# Altium schematic sheet BMD_RevB_B3_FPGA.SchDoc: FPGA
size 401 x 291 mm; DocumentNumber: 2; SheetNumber: 3; SheetTotal: 6
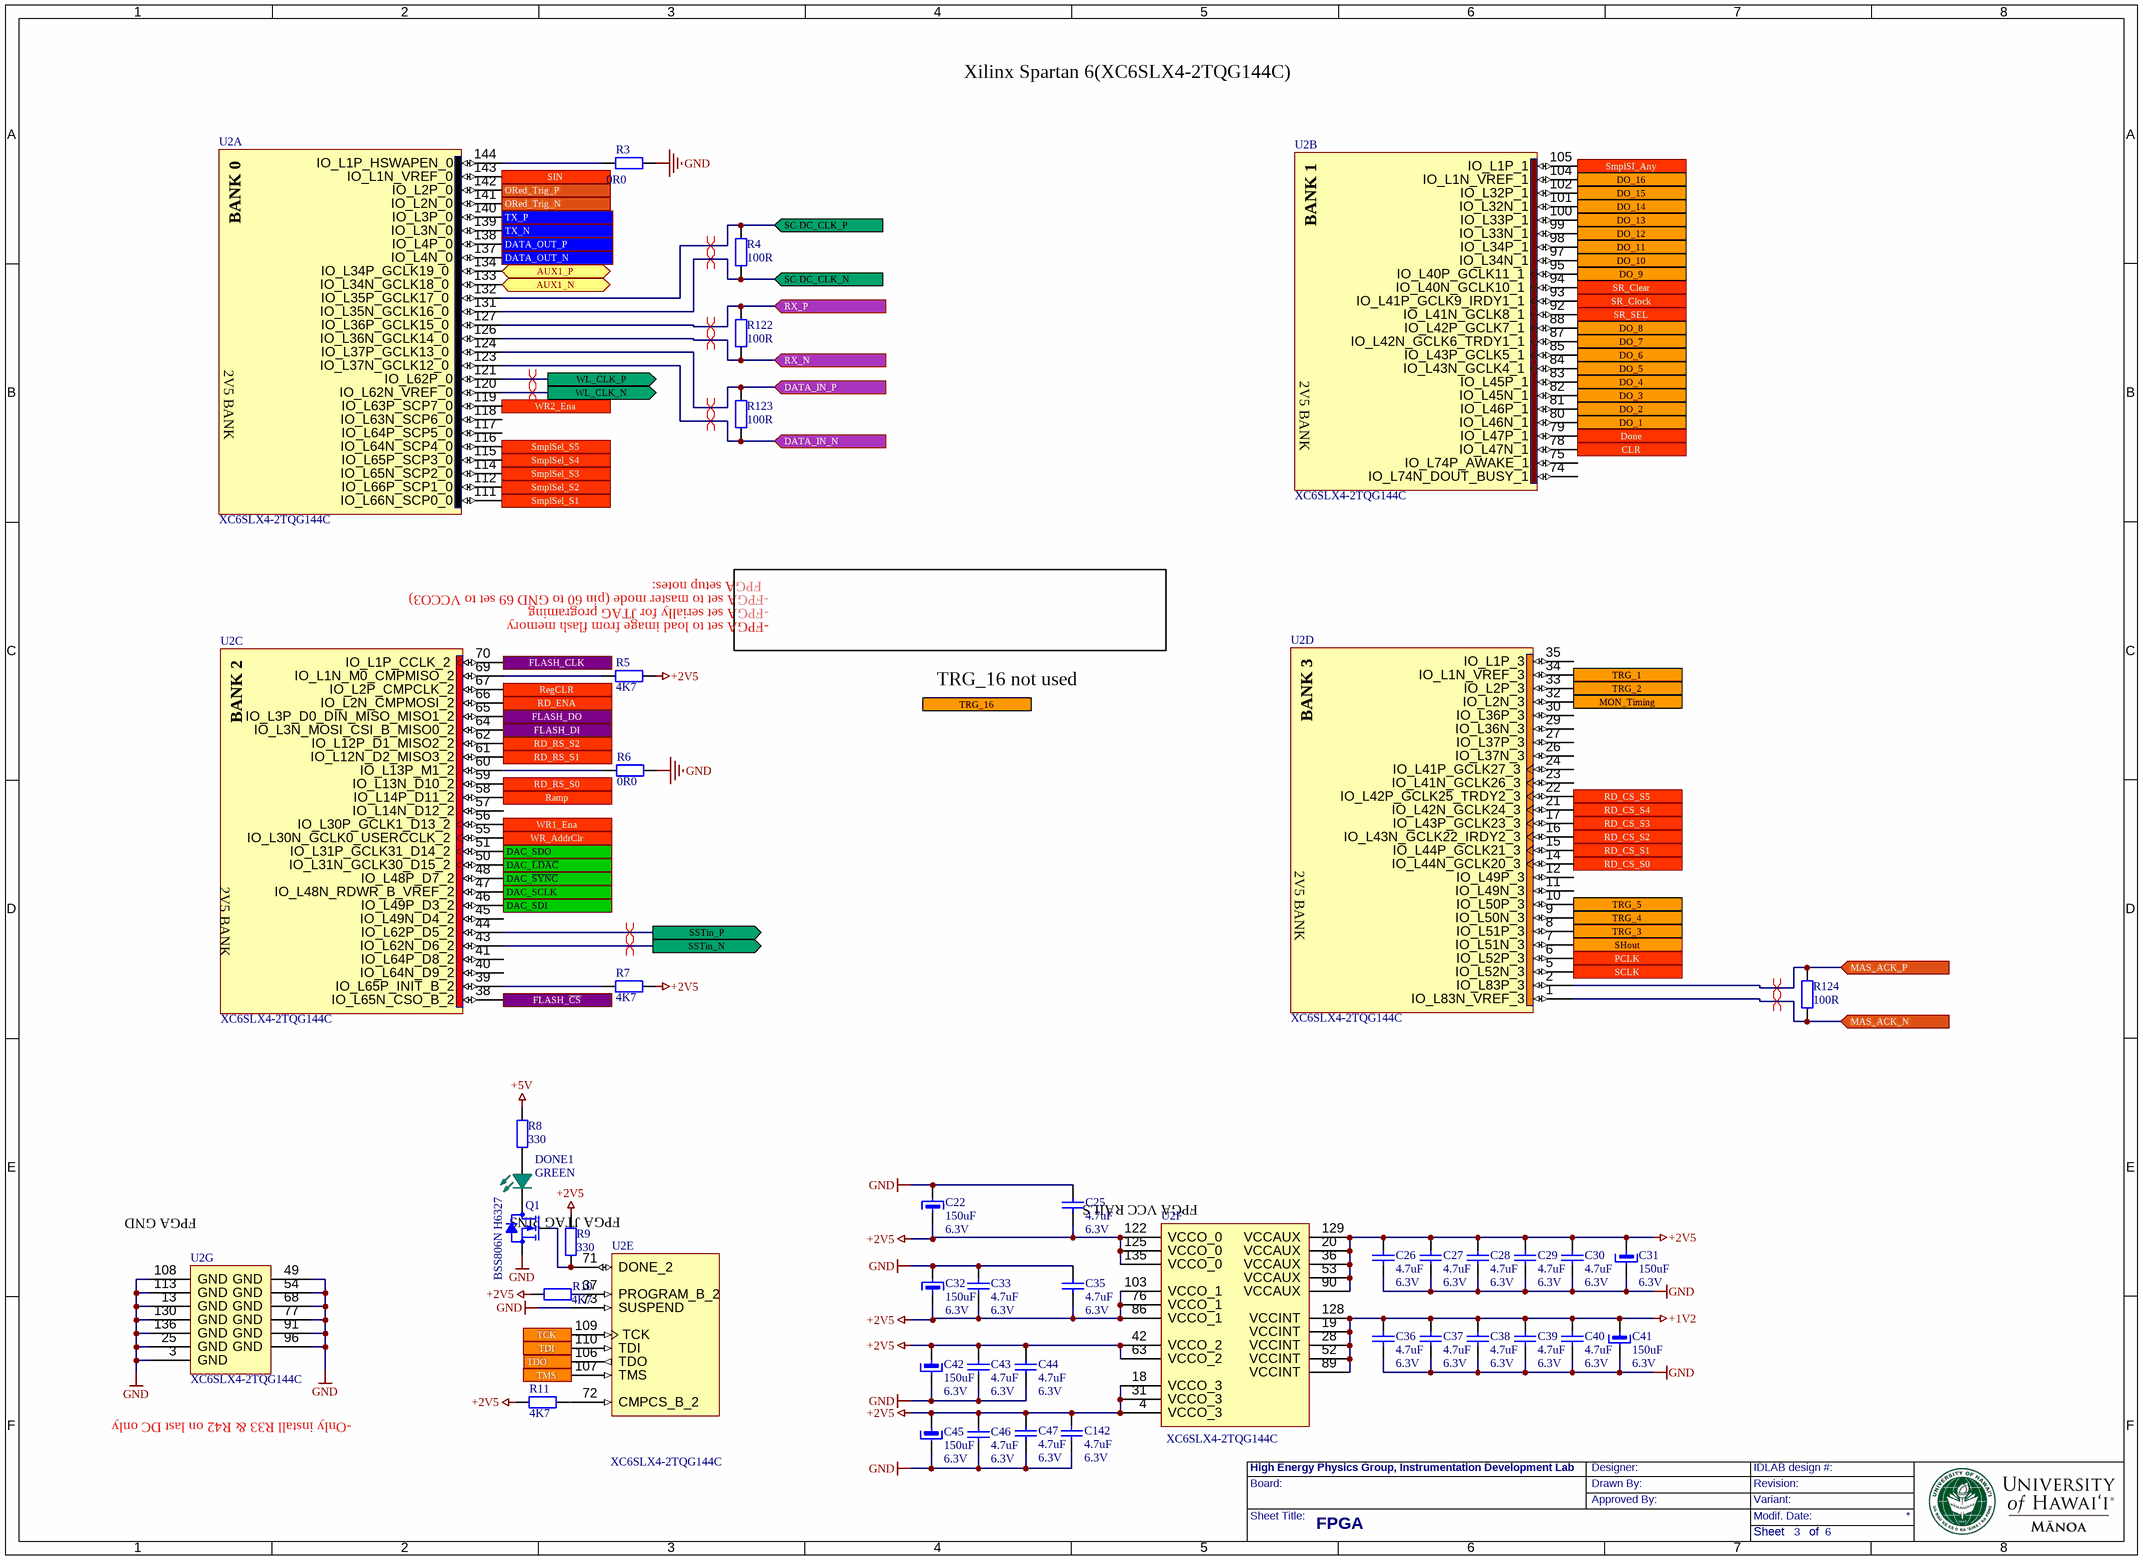
[diagram p0: BMD_RevB_B3_FPGA.SchDoc]

## Parts
C22  150uF  Voltage: 6.3V  [CTC-B3528-21]
C25  4.7uF  Voltage rating: 6.3V  [CC0402N1R]
C26  4.7uF  Voltage rating: 6.3V  [CC0402N1R]
C27  4.7uF  Voltage rating: 6.3V  [CC0402N1R]
C28  4.7uF  Voltage rating: 6.3V  [CC0402N1R]
C29  4.7uF  Voltage rating: 6.3V  [CC0402N1R]
C30  4.7uF  Voltage rating: 6.3V  [CC0402N1R]
C31  150uF  Voltage: 6.3V  [CTC-B3528-21]
C32  150uF  Voltage: 6.3V  [CTC-B3528-21]
C33  4.7uF  Voltage rating: 6.3V  [CC0402N1R]
C35  4.7uF  Voltage rating: 6.3V  [CC0402N1R]
C36  4.7uF  Voltage rating: 6.3V  [CC0402N1R]
C37  4.7uF  Voltage rating: 6.3V  [CC0402N1R]
C38  4.7uF  Voltage rating: 6.3V  [CC0402N1R]
C39  4.7uF  Voltage rating: 6.3V  [CC0402N1R]
C40  4.7uF  Voltage rating: 6.3V  [CC0402N1R]
C41  150uF  Voltage: 6.3V  [CTC-B3528-21]
C42  150uF  Voltage: 6.3V  [CTC-B3528-21]
C43  4.7uF  Voltage rating: 6.3V  [CC0402N1R]
C44  4.7uF  Voltage rating: 6.3V  [CC0402N1R]
C45  150uF  Voltage: 6.3V  [CTC-B3528-21]
C46  4.7uF  Voltage rating: 6.3V  [CC0402N1R]
C47  4.7uF  Voltage rating: 6.3V  [CC0402N1R]
C142  4.7uF  Voltage rating: 6.3V  [CC0402N1R]
DONE1  GREEN  [LED0603VG]
Q1  BSS806N H6327  [SOT23-1]
R3  0R0  [RC0402N1R]
R4  100R  [RC0402N1R]
R5  4K7  [RC0402N1R]
R6  0R0  [RC0402N1R]
R7  4K7  [RC0402N1R]
R8  330  [RC0402N1R]
R9  330  [RC0402N1R]
R10  4K7  [RC0402N1R]
R11  4K7  [RC0402N1R]
R122  100R  [RC0402N1R]
R123  100R  [RC0402N1R]
R124  100R  [RC0402N1R]
U2  XC6SLX4-2TQG144C  [TQG144_N]  (parts A,B,C,D,E,F,G of 7)

## Ports
AUX1_N (bidir), AUX1_P (bidir), CLR (out), DAC_SCLK (in), DAC_SDI (in), DAC_SDO (out), DAC_~{LDAC} (in), DAC_~{SYNC} (in), DATA_IN_N (in), DATA_IN_P (in), DATA_OUT_N (out), DATA_OUT_P (out), DO_1 (in), DO_2 (in), DO_3 (in), DO_4 (in), DO_5 (in), DO_6 (in), DO_7 (in), DO_8 (in), DO_9 (in), DO_10 (in), DO_11 (in), DO_12 (in), DO_13 (in), DO_14 (in), DO_15 (in), DO_16 (in), Done (out), FLASH_CLK (out), FLASH_DI (out), FLASH_DO (in), FLASH_~{CS} (out), MAS_ACK_N (in), MAS_ACK_P (in), MON_Timing (in), ORed_Trig_N (out), ORed_Trig_P (out), PCLK (out), Ramp (out), RD_CS_S0 (out), RD_CS_S1 (out), RD_CS_S2 (out), RD_CS_S3 (out), RD_CS_S4 (out), RD_CS_S5 (out), RD_ENA (out), RD_RS_S0 (out), RD_RS_S1 (out), RD_RS_S2 (out), RegCLR (out), RX_N (in), RX_P (in), SC-DC_CLK_N (in), SC-DC_CLK_P (in), SCLK (out), SHout (in), SIN (out), SmplSel_S1 (out), SmplSel_S2 (out), SmplSel_S3 (out), SmplSel_S4 (out), SmplSel_S5 (out), SmplSI_Any (out), SR_Clear (out), SR_Clock (out), SR_SEL (out), SSTin_N (out), SSTin_P (out), TCK (in), TDI (in), TDO (out), TMS (in), TRG_1 (in), TRG_2 (in), TRG_3 (in), TRG_4 (in), TRG_5 (in), TRG_16 (in), TX_N (out), TX_P (out), WL_CLK_N (out), WL_CLK_P (out), WR1_Ena (out), WR2_Ena (out), WR_AddrClr (out)

## Nets
+1V2: C36.2 C37.2 C38.2 C39.2 C40.2 C41.1 U2.19(VCCINT) U2.28(VCCINT) U2.52(VCCINT) U2.89(VCCINT) U2.128(VCCINT)
+2V5: C22.1 C25.1 C26.2 C27.2 C28.2 C29.2 C30.2 C31.1 C32.1 C33.1 C35.1 C42.1 C43.2 C44.2 C45.1 C46.2 C47.2 C142.2 R5.2 R7.2 R9.1 R10.2 R11.1 U2.4(VCCO_3) U2.18(VCCO_3) U2.20(VCCAUX) U2.31(VCCO_3) U2.36(VCCAUX) U2.42(VCCO_2) U2.53(VCCAUX) U2.63(VCCO_2) U2.76(VCCO_1) U2.86(VCCO_1) U2.90(VCCAUX) U2.103(VCCO_1) U2.122(VCCO_0) U2.125(VCCO_0) U2.129(VCCAUX) U2.135(VCCO_0)
+5V: R8.1
GND: C22.2 C25.2 C26.1 C27.1 C28.1 C29.1 C30.1 C31.2 C32.2 C33.2 C35.2 C36.1 C37.1 C38.1 C39.1 C40.1 C41.2 C42.2 C43.1 C44.1 C45.2 C46.1 C47.1 C142.1 Q1.2(S) R3.2 R6.2 U2.3(GND) U2.13(GND) U2.25(GND) U2.49(GND) U2.54(GND) U2.68(GND) U2.73(SUSPEND) U2.77(GND) U2.91(GND) U2.96(GND) U2.108(GND) U2.113(GND) U2.130(GND) U2.136(GND)
AUX1_N: U2.133(IO_L34N_GCLK18_0) ; port AUX1_N
AUX1_P: U2.134(IO_L34P_GCLK19_0) ; port AUX1_P
CLR: U2.78(IO_L47N_1) ; port CLR
DAC_~{LDAC}: U2.50(IO_L31N_GCLK30_D15_2) ; port DAC_~{LDAC}
DAC_~{SYNC}: U2.48(IO_L48P_D7_2) ; port DAC_~{SYNC}
DAC_SCLK: U2.47(IO_L48N_RDWR_B_VREF_2) ; port DAC_SCLK
DAC_SDI: U2.46(IO_L49P_D3_2) ; port DAC_SDI
DAC_SDO: U2.51(IO_L31P_GCLK31_D14_2) ; port DAC_SDO
DATA_IN_N: R123.1 U2.123(IO_L37N_GCLK12_0) ; port DATA_IN_N
DATA_IN_P: R123.2 U2.124(IO_L37P_GCLK13_0) ; port DATA_IN_P
DATA_OUT_N: U2.137(IO_L4N_0) ; port DATA_OUT_N
DATA_OUT_P: U2.138(IO_L4P_0) ; port DATA_OUT_P
DO_1: U2.80(IO_L46N_1) ; port DO_1
DO_2: U2.81(IO_L46P_1) ; port DO_2
DO_3: U2.82(IO_L45N_1) ; port DO_3
DO_4: U2.83(IO_L45P_1) ; port DO_4
DO_5: U2.84(IO_L43N_GCLK4_1) ; port DO_5
DO_6: U2.85(IO_L43P_GCLK5_1) ; port DO_6
DO_7: U2.87(IO_L42N_GCLK6_TRDY1_1) ; port DO_7
DO_8: U2.88(IO_L42P_GCLK7_1) ; port DO_8
DO_9: U2.95(IO_L40P_GCLK11_1) ; port DO_9
DO_10: U2.97(IO_L34N_1) ; port DO_10
DO_11: U2.98(IO_L34P_1) ; port DO_11
DO_12: U2.99(IO_L33N_1) ; port DO_12
DO_13: U2.100(IO_L33P_1) ; port DO_13
DO_14: U2.101(IO_L32N_1) ; port DO_14
DO_15: U2.102(IO_L32P_1) ; port DO_15
DO_16: U2.104(IO_L1N_VREF_1) ; port DO_16
Done: U2.79(IO_L47P_1) ; port Done
FLASH_~{CS}: U2.38(IO_L65N_CSO_B_2) ; port FLASH_~{CS}
FLASH_CLK: U2.70(IO_L1P_CCLK_2) ; port FLASH_CLK
FLASH_DI: U2.64(IO_L3N_MOSI_CSI_B_MISO0_2) ; port FLASH_DI
FLASH_DO: U2.65(IO_L3P_D0_DIN_MISO_MISO1_2) ; port FLASH_DO
MAS_ACK_N: R124.1 U2.1(IO_L83N_VREF_3) ; port MAS_ACK_N
MAS_ACK_P: R124.2 U2.2(IO_L83P_3) ; port MAS_ACK_P
MON_Timing: U2.32(IO_L2N_3) ; port MON_Timing
ORed_Trig_N: U2.141(IO_L2N_0) ; port ORed_Trig_N
ORed_Trig_P: U2.142(IO_L2P_0) ; port ORed_Trig_P
PCLK: U2.6(IO_L52P_3) ; port PCLK
Ramp: U2.58(IO_L14P_D11_2) ; port Ramp
RD_CS_S0: U2.14(IO_L44N_GCLK20_3) ; port RD_CS_S0
RD_CS_S1: U2.15(IO_L44P_GCLK21_3) ; port RD_CS_S1
RD_CS_S2: U2.16(IO_L43N_GCLK22_IRDY2_3) ; port RD_CS_S2
RD_CS_S3: U2.17(IO_L43P_GCLK23_3) ; port RD_CS_S3
RD_CS_S4: U2.21(IO_L42N_GCLK24_3) ; port RD_CS_S4
RD_CS_S5: U2.22(IO_L42P_GCLK25_TRDY2_3) ; port RD_CS_S5
RD_ENA: U2.66(IO_L2N_CMPMOSI_2) ; port RD_ENA
RD_RS_S0: U2.59(IO_L13N_D10_2) ; port RD_RS_S0
RD_RS_S1: U2.61(IO_L12N_D2_MISO3_2) ; port RD_RS_S1
RD_RS_S2: U2.62(IO_L12P_D1_MISO2_2) ; port RD_RS_S2
RegCLR: U2.67(IO_L2P_CMPCLK_2) ; port RegCLR
RX_N: R122.1 U2.126(IO_L36N_GCLK14_0) ; port RX_N
RX_P: R122.2 U2.127(IO_L36P_GCLK15_0) ; port RX_P
SC-DC_CLK_N: R4.1 U2.131(IO_L35N_GCLK16_0) ; port SC-DC_CLK_N
SC-DC_CLK_P: R4.2 U2.132(IO_L35P_GCLK17_0) ; port SC-DC_CLK_P
SCLK: U2.5(IO_L52N_3) ; port SCLK
SHout: U2.7(IO_L51N_3) ; port SHout
SIN: U2.143(IO_L1N_VREF_0) ; port SIN
SmplSel_S1: U2.111(IO_L66N_SCP0_0) ; port SmplSel_S1
SmplSel_S2: U2.112(IO_L66P_SCP1_0) ; port SmplSel_S2
SmplSel_S3: U2.114(IO_L65N_SCP2_0) ; port SmplSel_S3
SmplSel_S4: U2.115(IO_L65P_SCP3_0) ; port SmplSel_S4
SmplSel_S5: U2.116(IO_L64N_SCP4_0) ; port SmplSel_S5
SmplSI_Any: U2.105(IO_L1P_1) ; port SmplSI_Any
SR_Clear: U2.94(IO_L40N_GCLK10_1) ; port SR_Clear
SR_Clock: U2.93(IO_L41P_GCLK9_IRDY1_1) ; port SR_Clock
SR_SEL: U2.92(IO_L41N_GCLK8_1) ; port SR_SEL
SSTin_N: U2.43(IO_L62N_D6_2) ; port SSTin_N
SSTin_P: U2.44(IO_L62P_D5_2) ; port SSTin_P
TCK: U2.109(TCK) ; port TCK
TDI: U2.110(TDI) ; port TDI
TDO: U2.106(TDO) ; port TDO
TMS: U2.107(TMS) ; port TMS
TRG_1: U2.34(IO_L1N_VREF_3) ; port TRG_1
TRG_2: U2.33(IO_L2P_3) ; port TRG_2
TRG_3: U2.8(IO_L51P_3) ; port TRG_3
TRG_4: U2.9(IO_L50N_3) ; port TRG_4
TRG_5: U2.10(IO_L50P_3) ; port TRG_5
TX_N: U2.139(IO_L3N_0) ; port TX_N
TX_P: U2.140(IO_L3P_0) ; port TX_P
WL_CLK_N: U2.120(IO_L62N_VREF_0) ; port WL_CLK_N
WL_CLK_P: U2.121(IO_L62P_0) ; port WL_CLK_P
WR1_Ena: U2.56(IO_L30P_GCLK1_D13_2) ; port WR1_Ena
WR2_Ena: U2.119(IO_L63P_SCP7_0) ; port WR2_Ena
WR_AddrClr: U2.55(IO_L30N_GCLK0_USERCCLK_2) ; port WR_AddrClr
NetDONE1_1: DONE1.1(C) Q1.3(D)
NetDONE1_2: DONE1.2(A) R8.2
NetQ1_1: Q1.1(G) R9.2 U2.71(DONE_2)
NetR3_1: R3.1 U2.144(IO_L1P_HSWAPEN_0)
NetR5_1: R5.1 U2.69(IO_L1N_M0_CMPMISO_2)
NetR6_1: R6.1 U2.60(IO_L13P_M1_2)
NetR7_1: R7.1 U2.39(IO_L65P_INIT_B_2)
NetR10_1: R10.1 U2.37(PROGRAM_B_2)
NetR11_2: R11.2 U2.72(CMPCS_B_2)

Not connected (* = marked no-connect by the designer): U2 11(IO_L49N_3) 12(IO_L49P_3) 23(IO_L41N_GCLK26_3) 24(IO_L41P_GCLK27_3) 26(IO_L37N_3) 27(IO_L37P_3) 29(IO_L36N_3) 30(IO_L36P_3) 35(IO_L1P_3) 40(IO_L64N_D9_2) 41(IO_L64P_D8_2) 45(IO_L49N_D4_2) 57(IO_L14N_D12_2) 74(IO_L74N_DOUT_BUSY_1) 75(IO_L74P_AWAKE_1) 117(IO_L64P_SCP5_0) 118(IO_L63N_SCP6_0)

## Layout directives
differential pair: DATA_IN_N, DATA_IN_P, MAS_ACK_N, MAS_ACK_P, RX_N, RX_P, SC-DC_CLK_N, SC-DC_CLK_P, SSTin_N, SSTin_P, WL_CLK_N, WL_CLK_P

## Notes on the sheet
- Xilinx Spartan 6(XC6SLX4-2TQG144C)
- 2V5 BANK
- FPGA setup notes:
- -FPGA set to master mode (pin 60 to GND 69 set to VCCO3)
- -FPGA set serially for JTAG programing
- -FPGA set to load image from flash memory
- TRG_16 not used
- (near U2) FPGA GND
- FPGA JTAG PINS
- (near U2) FPGA VCC RAILS
- -Only install R33 & R42 on last DC only
- Board:
- High Energy Physics Group, Instrumentation Development Lab
- Drawn By:
- Designer:
- Approved By:
- Revision:
- IDLAB design #:
- Variant:
- Sheet Title:
- Modif. Date:
- Sheet       of
- (in symbol SPARTAN_6, part A) BANK 0
- (in symbol SPARTAN_6, part B) BANK 1
- (in symbol SPARTAN_6, part C) BANK 2
- (in symbol SPARTAN_6, part D) BANK 3

## Library data of the parts
C22 C31 C32 C41 C42 C45 = CAPT3528_150U6V3R0.5: 150µF Molded Tantalum Capacitors 6.3V 1411; Manufacturer: AVX; Manufacturer No: F930J157MBA; Comment2: 6.3V 0.5R  20%; Tech: SMDR; Package: Tant SMD B 3528-21; Supplier 1: Digi-Key; Supplier Part Number 1: 493-5741-1-ND
C25-C30 C33 C35-C40 C43 C44 C46 C47 C142 = CAPCC0402_4.7uF_6.3V: 4.7µF ±10% 6.3V X7R Ceramic Capacitor; Manufacturer: Samsung Electro-Mechanics America, Inc.; Manufacturer No: CL05A475KQ5NRNC; Tech: SMDR; Package: Cap Chip 0402; Supplier 1: Digi-Key; Supplier Part Number 1: 1276-1481-1-ND
DONE1 = LED-GREEN0603H: Green 572nm LED Indication - Discrete 2.2V 0603; Manufacturer: Rohm Semiconductor; Manufacturer No: SML-D12M8WT86; Tech: SMDR; Package: Led Chip 0603 Side; Supplier 1: Digi-Key; Supplier Part Number 1: 511-1578-6-ND
Q1 = MOSFET_N_Channel: MOSFET N-CH 20V 2.3A SOT23; Manufacturer: Infineon Technologies; Tech: SMDR; Package: SOT23; Manufacturer No: BSS806N H6327; Supplier 1: Digi-Key; Supplier Part Number 1: BSS806N H6327CT-ND
R3 R6 = RES0402-0R-1%100PPM: Chip Resistor 0402 62.5mW 1% 100ppm; Manufacturer: Panasonic; Manufacturer No: ERJ-2GE0R00X; Tech: SMDR; Package: Res Chip 0402; Supplier 1: Digi-Key; Supplier Part Number 1: P0.0JCT-ND
R4 R122-R124 = RES0402-100R-1%100PPM: RES SMD 100 OHM 1% 1/10W 0402; Manufacturer: Panasonic; Manufacturer No: ERJ-2RKF1000X; Tech: SMDR; Package: Res Chip 0402; Supplier 1: Digi-Key; Supplier Part Number 1: P100LCT-ND
R5 R7 R10 R11 = RES0402-4.7K-1%100PPM: RES SMD 4.7K OHM 1% 1/10W 0402; Manufacturer: Panasonic; Manufacturer No: ERJ-2RKF4701X; Tech: SMDR; Package: Res Chip 0402; Supplier 1: Digi-Key; Supplier Part Number 1: P4.70KLCT-ND
R8 R9 = RES0402_330_1%: RES SMD 330 OHM 0.1% 1/16W 0402; Manufacturer: Panasonic Electronic Components; Manufacturer No: ERA-2AEB331X; Tech: SMDR; Supplier 1: Digi-Key; Supplier Part Number 1: P330DCDKR-ND
U2 = SPARTAN_6: Spartan-6 LX 1.2V FPGA, 102 User I/Os, 144-Pin TQFP (0.5mm Pitch), Speed Grade 2, Commercial Grade, Pb-Free; Manufacturer: Xillinx Inc; Published: 1-Jul-2010; DatasheetVersion: ver1.6, Nov-2010; PackageVersion: ver1.2, Jun-2004; PackageReference: TQG144; Publisher: Altium Limited; PackageDescription: 144-Pin Thin Quad Flat Pack (TQG144) - Pb-Free; Supplier 1: Digi-Key; Supplier Part Number 1: 122-1734-ND; Code_JEDEC: MS-026-BFB; ComponentLink1Description: Manufacturer Link; ComponentLink1URL: http://www.xilinx.com; ComponentLink2Description: Spartan-6 Datasheet; ComponentLink2URL: http://www.xilinx.com/support/documentation/data_sheets/ds160.pdf; ComponentLink3Description: Spartan-6 Documents; ComponentLink3URL: http://www.xilinx.com/support/documentation/spartan-6.htm; ComponentLink4Description: Xilinx.com Home; ComponentLink4URL: http://www.xilinx.com; Manufacturer No: XC6SLX4-2TQG144C